# EAGLE design Central relay (EAGLE 6.4)
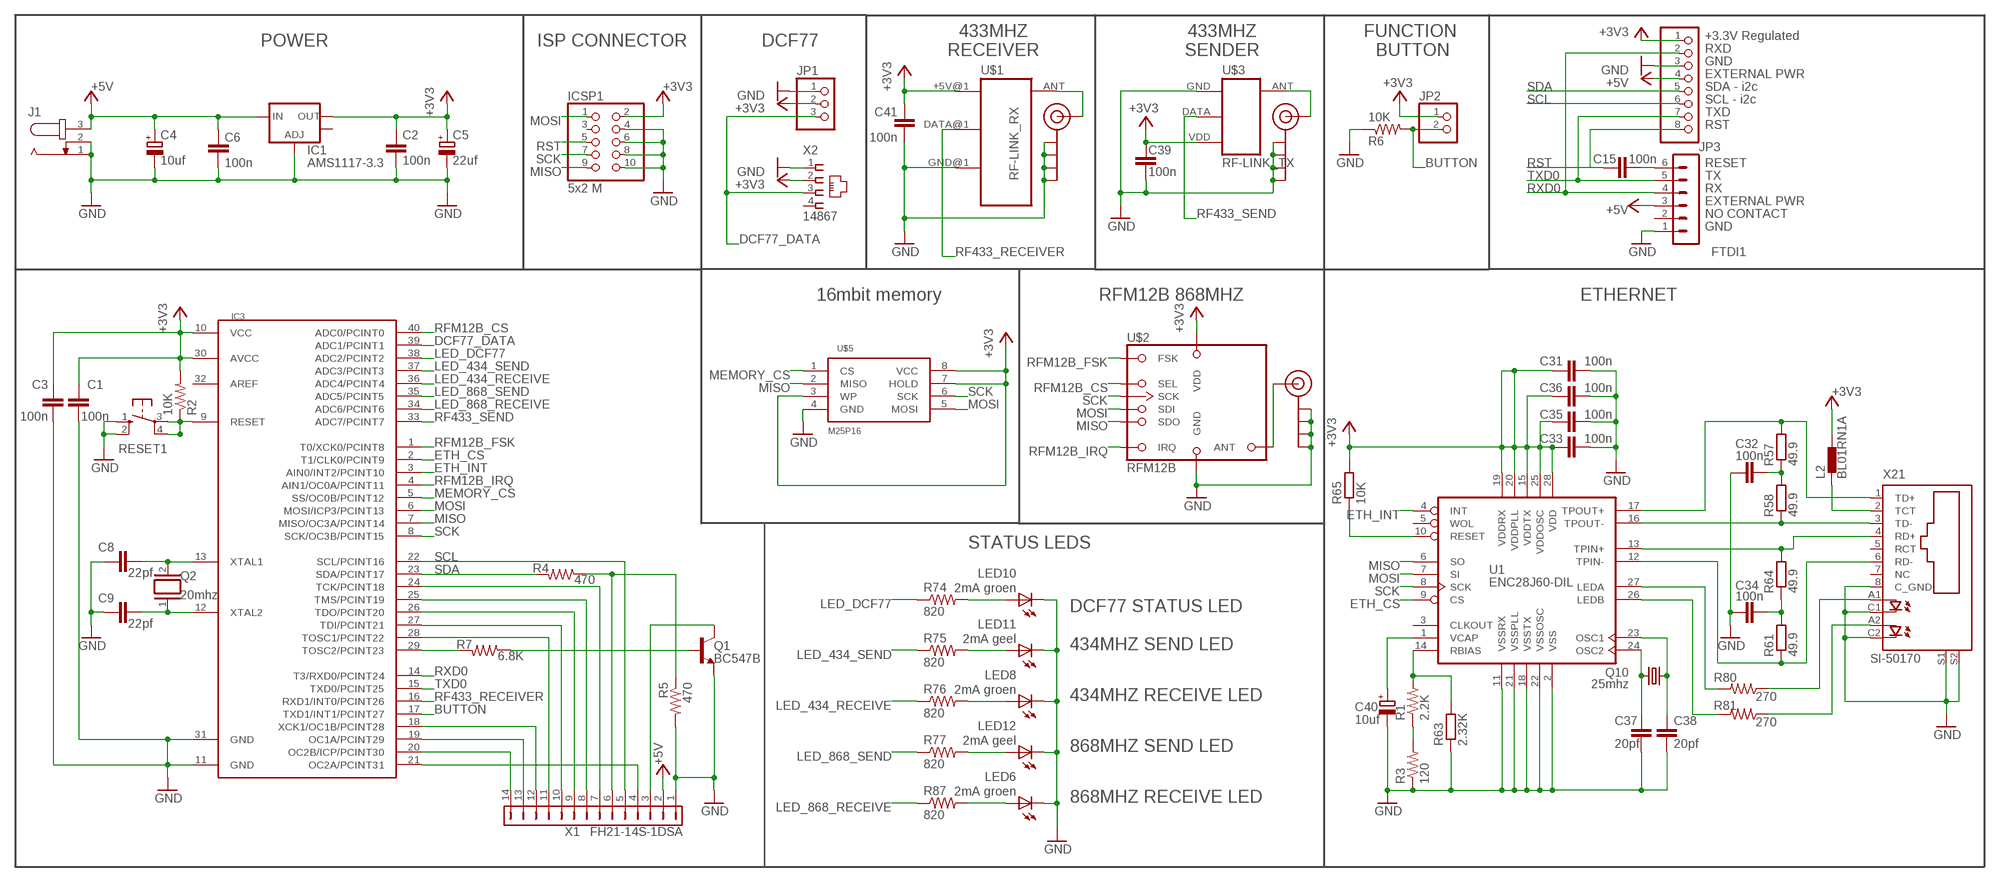
[diagram p0: schematic, sheet 1]

## Parts
C1  100n  CAP0805  [0805]
C2  100n  CAP0805  [0805]
C3  100n  CAP0805  [0805]
C4  10uf  CPOL-EUE2,5-6E  [E2,5-6E]
C5  22uf  CPOL-EUE2,5-6E  [E2,5-6E]
C6  100n  CAP0805  [0805]
C8  22pf  CAP0805  [0805]
C9  22pf  CAP0805  [0805]
C15  100n  C-EU025-025X050  [C025-025X050]
C31  100n  CAP0805  [0805]
C32  100n  CAP0805  [0805]
C33  100n  CAP0805  [0805]
C34  100n  CAP0805  [0805]
C35  100n  CAP0805  [0805]
C36  100n  CAP0805  [0805]
C37  20pf  CAP0805  [0805]
C38  20pf  CAP0805  [0805]
C39  100n  CAP0805  [0805]
C40  10uf  CPOL-EUE2,5-6E  [E2,5-6E]
C41  100n  CAP0805  [0805]
FTDI1  FTDI  MA06-1  [MA06-1]
IC1  AMS1117-3.3  V_REG_LM1117SOT223  [SOT223]
IC3  MEGA1284P  [DIL40]
ICSP1  5x2 M  PINHD-2X5  [2X05]
J1  JACK-PLUG0  [SPC4077]
J$1  SMA_EDGE  [SMA-EDGE]
J$2  SMA_EDGE  [SMA-EDGE]
J$3  SMA_EDGE  [SMA-EDGE]
JP1  PINHD-1X3  [1X03]
JP2  PINHD-1X2  [1X02]
JP3  PINHD-1X8  [1X08]
L2  BL01RN1A  [BL01RN1A]
LED6  2mA groen  LED5MM  [LED5MM]
LED8  2mA groen  LED5MM  [LED5MM]
LED10  2mA groen  LED5MM  [LED5MM]
LED11  2mA geel  LED5MM  [LED5MM]
LED12  2mA geel  LED5MM  [LED5MM]
Q1  BC547B  [TO92]
Q2  20mhz  XTAL/S  [QS]
Q10  25mhz  CRYSTALHC49S  [HC49/S]
R1  2.2K  RESISTOR0805-RES  [0805]
R2  10K  RESISTOR0805-RES  [0805]
R3  120  RESISTOR0805-RES  [0805]
R4  470  RESISTOR0805-RES  [0805]
R5  470  RESISTOR0805-RES  [0805]
R6  10K  RESISTOR0805-RES  [0805]
R7  6.8K  RESISTOR0805-RES  [0805]
R57  49.9  R-EU_0207/7  [0207/7]
R58  49.9  R-EU_0207/7  [0207/7]
R61  49.9  R-EU_0207/7  [0207/7]
R63  2.32K  R-EU_0207/7  [0207/7]
R64  49.9  R-EU_0207/7  [0207/7]
R65  10K  R-EU_0207/7  [0207/7]
R74  820  RESISTOR0805-RES  [0805]
R75  820  RESISTOR0805-RES  [0805]
R76  820  RESISTOR0805-RES  [0805]
R77  820  RESISTOR0805-RES  [0805]
R80  270  RESISTOR0805-RES  [0805]
R81  270  RESISTOR0805-RES  [0805]
R87  820  RESISTOR0805-RES  [0805]
RESET1  10-XX  [B3F-10XX]
U1  ENC28J60-DIL  [DIL28-3]
U$1  RF-LINK_RX  [RF-LINK_RX]
U$2  RFM12B  RFM12B_BREAKOUT_BASE  [RFM12B-BREAKOUT-BASE]
U$3  RF-LINK_TX  [RF-LINK_TX]
U$5  M25P16  SPI_FLASH-X25XXSMD  [SO08]
X1  FH21-14S-1DSA  [FH21-14S-1DSA]
X2  14867  [14867]
X21  SI-50170  [SI-50170]

## Nets
+3V3: C1.2 C2.2 C3.2 C5.+ C31.1 C33.1 C35.2 C36.2 C39.2 C41.1 IC1.2(OUT) IC3.10(VCC) IC3.30(AVCC) ICSP1.2 JP1.2 JP2.1 JP3.1 L2.2 R2.2 R65.2 U1.15(VDDTX) U1.19(VDDRX) U1.20(VDDPLL) U1.25(VDDOSC) U1.28(VDD) U$1.+5V@1(+5V) U$2.9(VDD) U$3.VDD(GND) U$5.3(WP) U$5.7(HOLD) U$5.8(VCC) X2.2
+5V: C4.+ C6.2 FTDI1.3 IC1.3(IN) J1.3 JP3.4 X1.2
BUTTON: IC3.17(TXD1/INT1/PCINT27) JP2.2 R6.2
DCF77_DATA: IC3.39(ADC1/PCINT1) JP1.3 X2.3
ETH_CS: IC3.2(T1/CLK0/PCINT9) U1.9(CS)
ETH_INT: IC3.3(AIN0/INT2/PCINT10) U1.4(INT)
GND [power]: C1.1 C2.1 C3.1 C4.- C5.- C6.1 C8.2 C9.2 C31.2 C32.1 C33.2 C34.1 C35.1 C36.1 C37.1 C38.1 C39.1 C40.- C41.2 FTDI1.1 IC1.1(ADJ) IC3.11(GND) IC3.31(GND) ICSP1.4 ICSP1.6 ICSP1.8 ICSP1.10 J1.1 J1.2 J$1.GND@0(GND) J$1.GND@1(GND) J$1.GND@2(GND) J$1.GND@3(GND) J$2.GND@0(GND) J$2.GND@1(GND) J$2.GND@2(GND) J$2.GND@3(GND) J$3.GND@0(GND) J$3.GND@1(GND) J$3.GND@2(GND) J$3.GND@3(GND) JP1.1 JP3.3 LED6.K(C) LED8.K(C) LED10.K(C) LED11.K(C) LED12.K(C) Q1.1(E) R3.1 R5.2 R6.1 R63.1 RESET1.1(S) RESET1.2(S1) U1.2(VSS) U1.11(VSSRX) U1.18(VSSTX) U1.21(VSSPLL) U1.22(VSSOSC) U$1.GND@1(GND) U$2.10(GND) U$3.GND(+5V) U$5.4(GND) X1.1 X2.1 X21.8(C_GND) X21.C1(C) X21.C2(C1) X21.S1 X21.S2
LED_434_RECEIVE: IC3.36(ADC4/PCINT4) R76.1
LED_434_SEND: IC3.37(ADC3/PCINT3) R75.1
LED_868_RECEIVE: IC3.34(ADC6/PCINT6) R87.1
LED_868_SEND: IC3.35(ADC5/PCINT5) R77.1
LED_DCF77: IC3.38(ADC2/PCINT2) R74.1
MEMORY_CS: IC3.5(SS/OC0B/PCINT12) U$5.1(CS)
MISO: IC3.7(MISO/OC3A/PCINT14) ICSP1.9 U1.6(SO) U$2.1(SDO) U$5.2(MISO)
MOSI: IC3.6(MOSI/ICP3/PCINT13) ICSP1.1 U1.7(SI) U$2.12(SDI) U$5.5(MOSI)
N$1: J$2.SIG(SIGNAL) U$1.ANT
N$2: R80.1 X21.A1(A)
N$3: J$3.SIG(SIGNAL) U$3.ANT
N$4: R1.1 R3.2
N$5: R1.2 R63.2 U1.14(RBIAS)
N$6: R81.1 X21.A2(A1)
N$7: LED8.A R76.2
N$8: IC3.21(OC2A/PCINT31) X1.4
N$9: Q1.3(C) X1.3
N$10: Q1.2(B) R7.1
N$11: R4.1 R5.1 X1.6
N$12: IC3.29(TOSC2/PCINT23) R7.2
N$13: LED11.A R75.2
N$17: IC3.24(TCK/PCINT18) X1.7
N$18: IC3.25(TMS/PCINT19) X1.8
N$19: IC3.26(TDO/PCINT20) X1.9
N$20: LED10.A R74.2
N$23: IC3.27(TDI/PCINT21) X1.10
N$24: IC3.28(TOSC1/PCINT22) X1.11
N$28: LED6.A R87.2
N$29: LED12.A R77.2
N$30: C8.1 IC3.13(XTAL1) Q2.2
N$33: L2.1 X21.2(TCT)
N$34: C34.2 R61.2 R64.1
N$35: R57.2 U1.17(TPOUT+) X21.1(TD+)
N$37: R58.1 U1.16(TPOUT-) X21.3(TD-)
N$39: IC3.20(OC2B/ICP/PCINT30) X1.14
N$40: IC3.19(OC1A/PCINT29) X1.13
N$41: IC3.18(XCK1/OC1B/PCINT28) X1.12
N$43: C9.1 IC3.12(XTAL2) Q2.1
N$49: C15.2 FTDI1.6
N$94: R64.2 U1.13(TPIN+) X21.4(RD+)
N$95: R61.1 U1.12(TPIN-) X21.6(RD-)
N$96: C37.2 Q10.1 U1.24(OSC2)
N$97: C38.2 Q10.2 U1.23(OSC1)
N$98: C40.+ U1.1(VCAP)
N$100: R65.1 U1.10(RESET)
N$101: C32.2 R57.1 R58.2
N$141: R80.2 U1.27(LEDA)
N$142: R81.2 U1.26(LEDB)
N$145: J$1.SIG(SIGNAL) U$2.8(ANT)
RF433_RECEIVER: IC3.16(RXD1/INT0/PCINT26) U$1.DATA@1(DATA)
RF433_SEND: IC3.33(ADC7/PCINT7) U$3.DATA
RFM12B_CS: IC3.40(ADC0/PCINT0) U$2.14(SEL)
RFM12B_FSK: IC3.1(T0/XCK0/PCINT8) U$2.3(FSK)
RFM12B_IRQ: IC3.4(AIN1/OC0A/PCINT11) U$2.2(IRQ)
RST: C15.1 IC3.9(RESET) ICSP1.5 JP3.8 R2.1 RESET1.3(P) RESET1.4(P1)
RXD0: FTDI1.4 IC3.14(T3/RXD0/PCINT24) JP3.2
SCK: IC3.8(SCK/OC3B/PCINT15) ICSP1.7 U1.8(SCK) U$2.13(SCK) U$5.6(SCK)
SCL: IC3.22(SCL/PCINT16) JP3.6 X1.5
SDA: IC3.23(SDA/PCINT17) JP3.5 R4.2
TXD0: FTDI1.5 IC3.15(TXD0/PCINT25) JP3.7
Unconnected: FTDI1.2 IC1.4(OUT) IC3.32(AREF) ICSP1.3 U1.3(CLKOUT) U1.5(WOL) X2.4 X21.5(RCT) X21.7(NC)

## Notes on the sheet
- POWER | ISP CONNECTOR | DCF77
- 433MHZ
  RECEIVER
- 433MHZ
  SENDER
- FUNCTION 
  BUTTON
- +3.3V Regulated
- RXD
- GND
- EXTERNAL PWR
- SDA - i2c
- SCL - i2c
- TXD
- RST
- RESET
- TX
- RX
- EXTERNAL PWR
- NO CONTACT
- GND
- 16mbit memory | RFM12B 868MHZ | ETHERNET
- STATUS LEDS
- DCF77 STATUS LED
- 434MHZ SEND LED
- 434MHZ RECEIVE LED
- 868MHZ SEND LED
- 868MHZ RECEIVE LED

## Library data of the parts
C1-C3 C6 C8 C9 C31-C39 C41 = SparkFun-Capacitors:CAP: Capacitor Standard 0603 ceramic capacitor, and 0.1" leaded capacitor.
C4 C5 = rcl:CPOL-EU: POLARIZED CAPACITOR, European symbol
C15 = resistor:C-EU: CAPACITOR, European symbol
C40 = resistor:CPOL-EU: POLARIZED CAPACITOR, European symbol
FTDI1 = JeeLabs:MA06-1: PIN HEADER
IC1 = SparkFun-PowerIC:V_REG_LM1117: Voltage Regulator LM1117 Standard adjustable voltage regulator but in SMD form. Spark Fun Electronics SKU : COM-00595
IC3 = 1284p:MEGA1284P: Atmel ATmega1284P 8-bit AVR Microcontroller
ICSP1 = pinhead:PINHD-2X5: PIN HEADER
J1 = con-jack:JACK-PLUG: DC POWER JACK Power Jack, DC, Right Angle, Through Hole, Rated 5A at 16VDC, PC Terminals Distributor: Farnell (www.Farnell.de) Drawing: 84N1161.pdf / 84N1162.pdf Manufacturer: SPC Technology (www.spctechnology.com) Type: SPC4077 / SPC 4078; OC_FARNELL: unknown; OC_NEWARK: unknown
J$1-J$3 = SparkFun-Connectors:SMA_EDGE: SMA Antenna Connector End launch SMA connector. The paste layer has been removed so that the connector can be hand soldered onto the board after reflow.
JP1 = adafruit:PINHD-1X3: PIN HEADER
JP2 = pinhead:PINHD-1X2: PIN HEADER
JP3 = pinhead:PINHD-1X8: PIN HEADER
L2 = inductors:BL0: Noise Suppression Products/EMI Suppression Filters, Lead EMIFIL(R) Inductor Type Source: http://www.murata.com .. BL01RN1_DS.pdf
LED6 LED8 LED10-LED12 = led:LED: LED OSRAM: - CHIPLED LG R971, LG N971, LY N971, LG Q971, LY Q971, LO R971, LY R971 LH N974, LH R974 LS Q976, LO Q976, LY Q976 LO Q996 - Hyper CHIPLED LW Q18S LB Q993, LB Q99A, LB R99A - SideLED LS A670, LO A670, LY A670, LG A670, LP A670 LB A673, LV A673, LT A673, LW A673 LH A674 LY A675 LS A676, LA A676, LO A676, LY A676, LW A676 LS A679, LY A679, LG A679 - Hyper Micro SIDELED® LS Y876, LA Y876, LO Y876, LY Y876 LT Y87S - SmartLED LW L88C, LW L88S LB L89C, LB L89S, LG L890 LS L89K, LO L89K, LY L89K LS L896, LA L896, LO L896, LY L896 - TOPLED LS T670, LO T670, LY T670, LG T670, LP T670 LSG T670, LSP T670, LSY T670, LOP T670, LYG T670 LG T671, LOG T671, LSG T671 LB T673, LV T673, LT T673, LW T673 LH T674 LS T676, LA T676, LO T676, LY T676, LB T676, LH T676, LSB T676, LW T676 LB T67C, LV T67C, LT T67C, LS T67K, LO T67K, LY T67K, LW E67C LS E67B, LA E67B, LO E67B, LY E67B, LB E67C, LV E67C, LT E67C LW T67C LS T679, LY T679, LG T679 LS T770, LO T770, LY T770, LG T770, LP T770 LB T773, LV T773, LT T773, LW T773 LH T774 LS E675, LA E675, LY E675, LS T675 LS T776, LA T776, LO T776, LY T776, LB T776 LHGB T686 LT T68C, LB T68C - Hyper Mini TOPLED® LB M676 - Mini TOPLED Santana® LG M470 LS M47K, LO M47K, LY M47K Source: http://www.osram.convergy.de LUXEON: - LUMILED® LXK2-PW12-R00, LXK2-PW12-S00, LXK2-PW14-U00, LXK2-PW14-V00 LXK2-PM12-R00, LXK2-PM12-S00, LXK2-PM14-U00 LXK2-PE12-Q00, LXK2-PE12-R00, LXK2-PE12-S00, LXK2-PE14-T00, LXK2-PE14-U00 LXK2-PB12-K00, LXK2-PB12-L00, LXK2-PB12-M00, LXK2-PB14-N00, LXK2-PB14-P00, LXK2-PB14-Q00 LXK2-PR12-L00, LXK2-PR12-M00, LXK2-PR14-Q00, LXK2-PR14-R00 LXK2-PD12-Q00, LXK2-PD12-R00, LXK2-PD12-S00 LXK2-PH12-R00, LXK2-PH12-S00 LXK2-PL12-P00, LXK2-PL12-Q00, LXK2-PL12-R00 Source: www.luxeon.com KINGBRIGHT: KA-3528ASYC Source: www.kingbright.com
Q1 = transistor-npn:BC547*: NPN Transistor
Q2 = special:XTAL/S: CRYSTAL
Q10 = crystal:CRYSTAL: CRYSTAL; OC_FARNELL: 1667008; OC_NEWARK: unknown
R1-R7 R74-R77 R80 R81 R87 = SparkFun-Resistors:RESISTOR: Resistor Basic schematic elements and footprints for 0603, 1206, and PTH resistors.
R57 R58 R61 R63-R65 = resistor:R-EU_: RESISTOR, European symbol
RESET1 = switch-omron:10-XX: OMRON SWITCH; MPN: B3F-1000; OC_FARNELL: 176432; OC_NEWARK: 36M3542
U1 = enc28j60:ENC28J60-*: Microchip 10Mbit Ethernet controller with SPI interface Improved SOIC28 layout (pads in 0.01 raster, pin1 slightly smaller). Pin 6 (SO) changed from Out (paralleling several Outs gives an error) to OC. Author: Profi from mikrocontroller.net - forum Date: 2006.0827
U$1 = SparkFun-RF:RF-LINK_RX: RF Link receivers- WRL-8947, 8948, 8949, 8950
U$2 = RFM12_BREAKOUT:RFM12B_BREAKOUT_BASE
U$3 = SparkFun-RF:RF-LINK_TX: RF Link transmitters WRL-8945, 8946
U$5 = SparkFun-DigitalIC:SPI_FLASH-X25XX: 8pin SPI Flash series x25xx. Works with devices like W25X32 and BR25L32
X1 = con-hirose:FH21-14S-1DSA: FPC CONNECTOR Source: con-hirose.lbr from Bob Starr <rtzaudio@mindspring.com>; OC_FARNELL: unknown; OC_NEWARK: unknown
X2 = con-4ucon:14867: RJ11 Connector Source: 4UCON TECHNOLOGY INC. 14867.pdf; OC_FARNELL: unknown; OC_NEWARK: unknown
X21 = con-stewart:SI-50170: Ethernet Connector MagJack (R) Source: www.stewartconnector.com .. si-50170.pdf; OC_FARNELL: unknown; OC_NEWARK: unknown

## Net classes
1 power: width 0.381 mm, clearance 0.254 mm
2 gnd: width 0.305 mm, drill 0.559 mm, clearance 0.254 mm
3 usbvcc: width 0.508 mm, drill 0.61 mm, clearance 0.254 mm

## Board
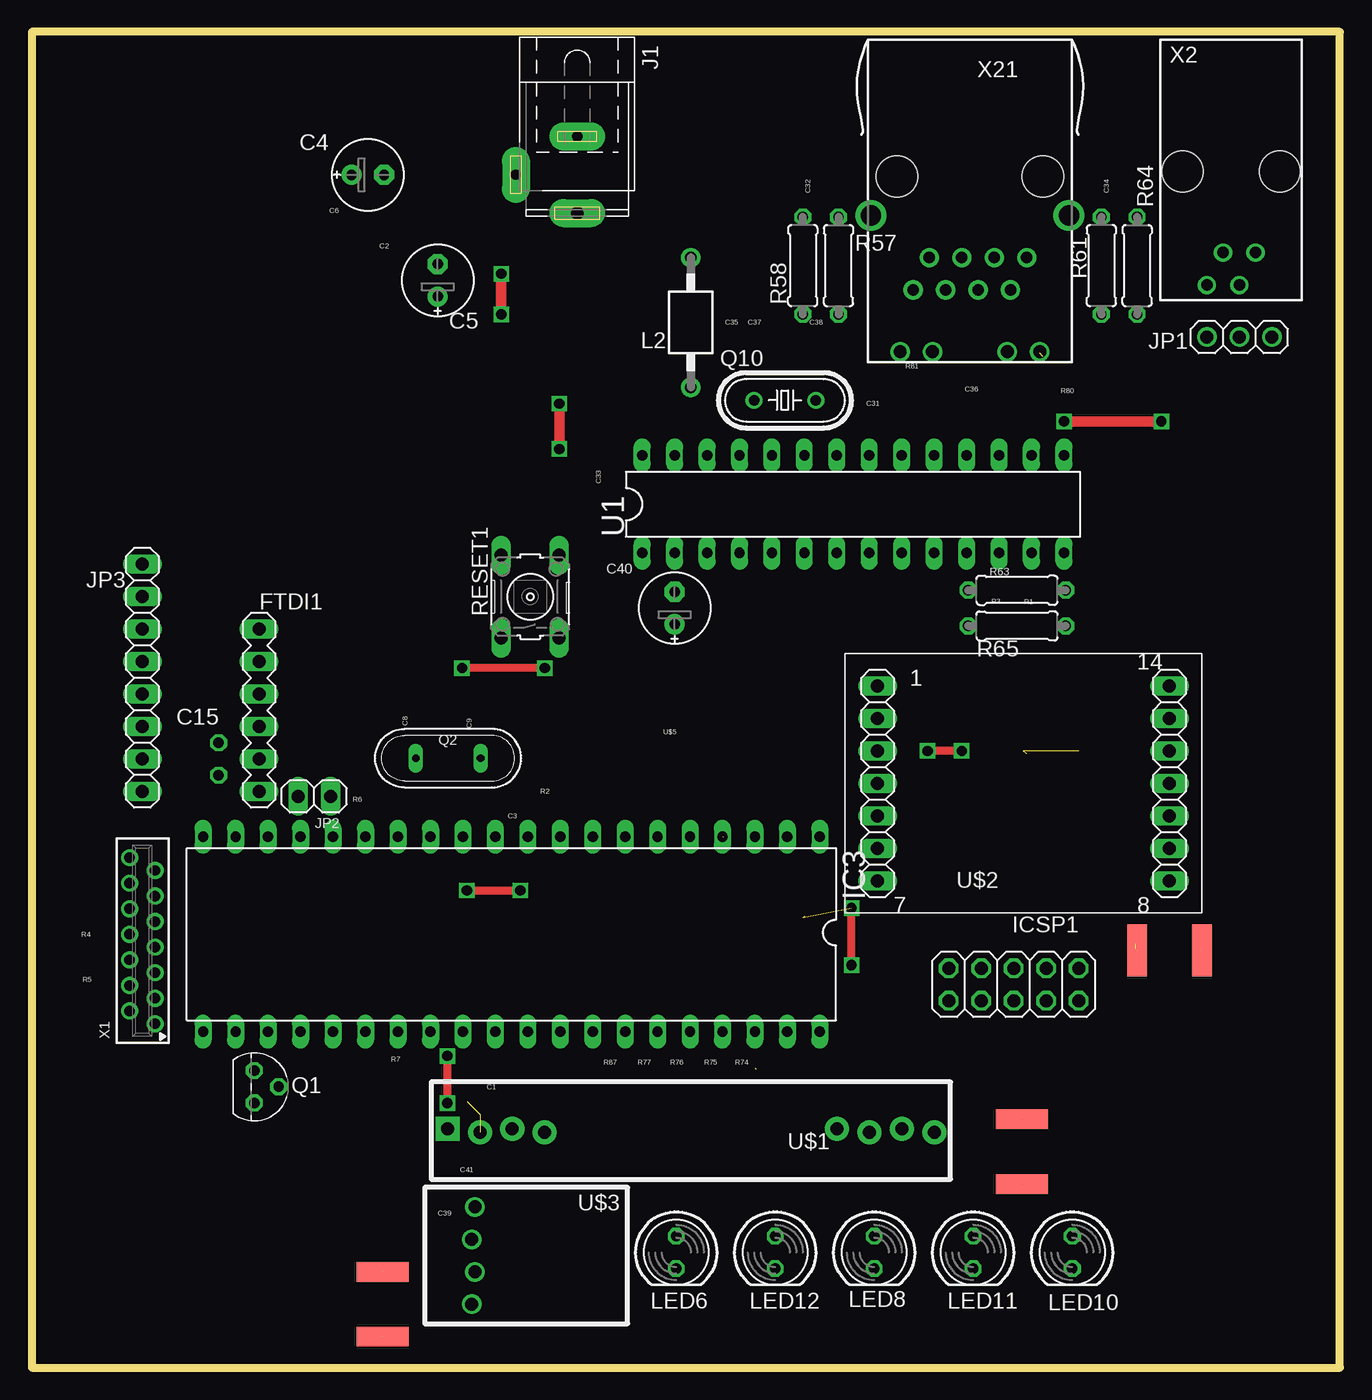
[diagram p1: board, top side]
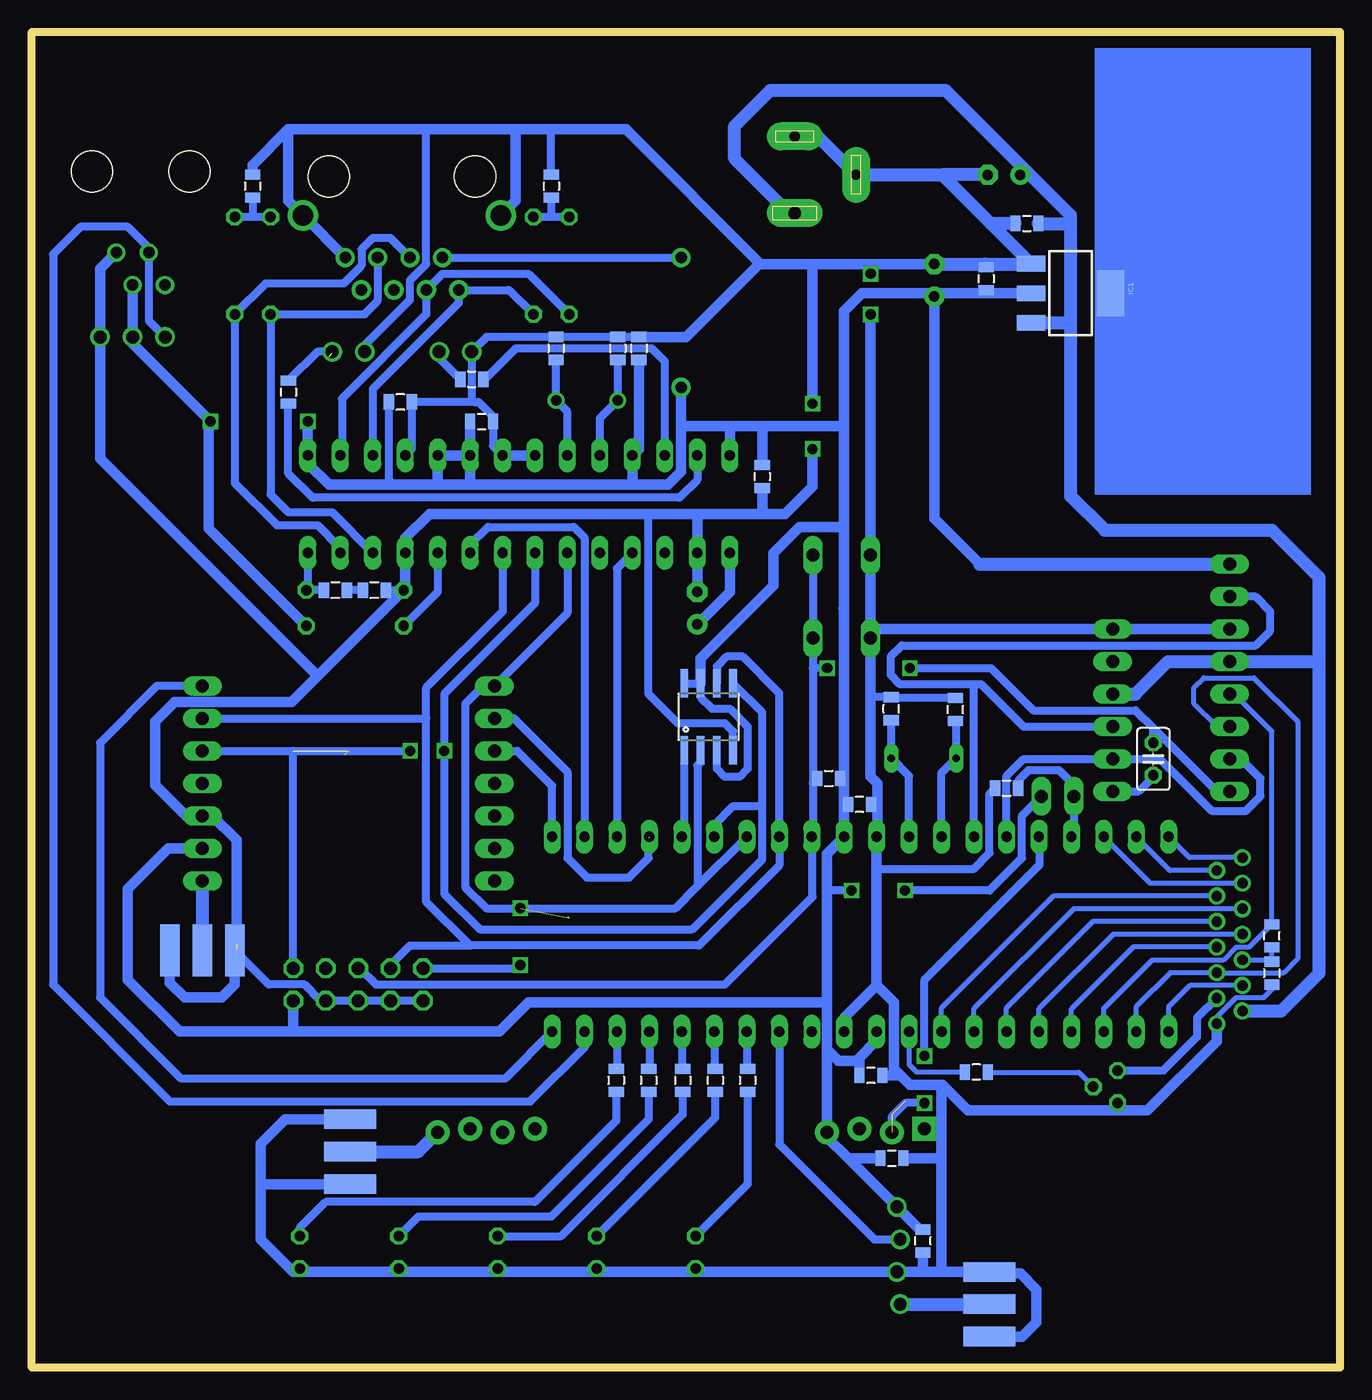
[diagram p2: board, bottom side, seen from below]

Size 102.36 x 104.52 mm. Coordinates in mm from the lower left corner, seen from the top.
Outline: 0,0 102.36,0 102.36,104.52 0,104.52 0,0
Copper layers (1*16): Top 0.035mm / dielectric 1.5mm / Bottom 0.035mm
Design rules "default *": minimum track width 10mil, minimum drill 24mil, track to track 8mil, track to pad 8mil, pad to pad 8mil, via to via 8mil, smd to smd 8mil, copper to edge 40mil, drill to drill 8mil, minimum pad ring 10mil, minimum via ring 8mil, stop-mask expansion 4mil, vias tented up to drill 0mil, thermal gap 10mil

### Footprints (pad centres in the part's own frame; a part is rotated, then mirrored left to right if it is on the bottom)
0805 = smd 0.8 x 1.2: 1 -0.9,0; 2 0.9,0
E2,5-6E = drill 0.813 pad 1.575: + -1.27,0 | drill 0.813 pad 1.575 octagon: - 1.27,0
C025-025X050 = drill 0.813 octagon: 1 -1.27,0; 2 1.27,0
MA06-1 = drill 1.016 long: 1 0,0; 2 2.54,0; 3 5.08,0; 4 7.62,0; 5 10.16,0; 6 12.7,0
SOT223 = smd 1.219 x 2.235: 1 -2.311,-3.099; 2 0,-3.099; 3 2.311,-3.099 | smd 3.6 x 2.2: 4 0,3.099
DIL40 = drill 0.813 long: 1 -24.13,-7.62; 2 -21.59,-7.62; 3 -19.05,-7.62; 4 -16.51,-7.62; 5 -13.97,-7.62; 6 -11.43,-7.62; 7 -8.89,-7.62; 8 -6.35,-7.62; 9 -3.81,-7.62; 10 -1.27,-7.62; 11 1.27,-7.62; 12 3.81,-7.62; 13 6.35,-7.62; 14 8.89,-7.62; 15 11.43,-7.62; 16 13.97,-7.62; 17 16.51,-7.62; 18 19.05,-7.62; 19 21.59,-7.62; 20 24.13,-7.62; 21 24.13,7.62; 22 21.59,7.62; 23 19.05,7.62; 24 16.51,7.62; 25 13.97,7.62; 26 11.43,7.62; 27 8.89,7.62; 28 6.35,7.62; 29 3.81,7.62; 30 1.27,7.62; 31 -1.27,7.62; 32 -3.81,7.62; 33 -6.35,7.62; 34 -8.89,7.62; 35 -11.43,7.62; 36 -13.97,7.62; 37 -16.51,7.62; 38 -19.05,7.62; 39 -21.59,7.62; 40 -24.13,7.62
2X05 = drill 1.016 octagon: 1 -5.08,-1.27; 2 -5.08,1.27; 3 -2.54,-1.27; 4 -2.54,1.27; 5 0,-1.27; 6 0,1.27; 7 2.54,-1.27; 8 2.54,1.27; 9 5.08,-1.27; 10 5.08,1.27
SPC4077 = drill 0.8 pad 2.184 long: 1 -3,0; 2 0,-4.8 | drill 1 pad 2.184 long: 3 3,0
SMA-EDGE = smd 1.524 x 4.064: GND@0 0,0; GND@1 5.08,0; SIG 2.54,0 | smd 1.524 x 4.064 bottom: GND@2 0,0; GND@3 5.08,0
1X03 = drill 1.016: 1 -2.54,0; 2 0,0; 3 2.54,0
1X02 = drill 1.016 long: 1 -1.27,0; 2 1.27,0
1X08 = drill 1.016 long: 1 -8.89,0; 2 -6.35,0; 3 -3.81,0; 4 -1.27,0; 5 1.27,0; 6 3.81,0; 7 6.35,0; 8 8.89,0
BL01RN1A = drill 0.9 pad 1.5: 1 -5.08,0; 2 5.08,0
LED5MM = drill 0.813 octagon: A -1.27,0; K 1.27,0
TO92 = drill 0.813 octagon: 1 1.27,0; 2 0,1.905; 3 -1.27,0
QS = drill 0.61 long: 1 -2.54,0; 2 2.54,0
HC49/S = drill 0.813: 1 -2.413,0; 2 2.413,0
0207/7 = drill 0.813 octagon: 1 -3.81,0; 2 3.81,0
B3F-10XX = drill 1.016 long: 1 -3.251,2.261; 2 3.251,2.261; 3 -3.251,-2.261; 4 3.251,-2.261
DIL28-3 = drill 0.813 long: 1 -16.51,-3.81; 2 -13.97,-3.81; 3 -11.43,-3.81; 4 -8.89,-3.81; 5 -6.35,-3.81; 6 -3.81,-3.81; 7 -1.27,-3.81; 8 1.27,-3.81; 9 3.81,-3.81; 10 6.35,-3.81; 11 8.89,-3.81; 12 11.43,-3.81; 13 13.97,-3.81; 14 16.51,-3.81; 15 16.51,3.81; 16 13.97,3.81; 17 11.43,3.81; 18 8.89,3.81; 19 6.35,3.81; 20 3.81,3.81; 21 1.27,3.81; 22 -1.27,3.81; 23 -3.81,3.81; 24 -6.35,3.81; 25 -8.89,3.81; 26 -11.43,3.81; 27 -13.97,3.81; 28 -16.51,3.81
RF-LINK_RX = drill 1.016 pad 1.88: +5V@1 7.62,-0.127; +5V@2 30.48,0.127; ANT 38.1,-0.127; DATA@1 2.54,-0.127; DATA@2 5.08,0.127; GND@2 33.02,-0.127; GND@3 35.56,0.127 | drill 1.016 pad 1.88 square: GND@1 0,0.127
RFM12B-BREAKOUT-BASE = drill 1.016 long: 1 -11.43,7.62; 2 -11.43,5.08; 3 -11.43,2.54; 4 -11.43,0; 5 -11.43,-2.54; 6 -11.43,-5.08; 7 -11.43,-7.62; 8 11.43,-7.62; 9 11.43,-5.08; 10 11.43,-2.54; 11 11.43,0; 12 11.43,2.54; 13 11.43,5.08; 14 11.43,7.62
RF-LINK_TX = drill 1.016 pad 1.524: ANT 7.62,-0.127; DATA 2.54,-0.127; GND 5.08,0.127; VDD 0,0.127
SO08 = smd 0.61 x 2.21: 1 -1.905,-2.616; 2 -0.635,-2.616; 3 0.635,-2.616; 4 1.905,-2.616; 5 1.905,2.616; 6 0.635,2.616; 7 -0.635,2.616; 8 -1.905,2.616
FH21-14S-1DSA = drill 0.813: 1 -6.5,-1; 2 -5.5,1; 3 -4.5,-1; 4 -3.5,1; 5 -2.5,-1; 6 -1.5,1; 7 -0.5,-1; 8 0.5,1; 9 1.5,-1; 10 2.5,1; 11 3.5,-1; 12 4.5,1; 13 5.5,-1; 14 6.5,1
14867 = drill 0.9 pad 1.422: 1 -1.905,6.35; 2 -0.635,8.89; 3 0.635,6.35; 4 1.905,8.89 | hole 3.2: -3.81,0; 3.81,0
SI-50170 = drill 0.9 pad 1.5: 1 4.445,5.842; 2 3.175,3.302; 3 1.905,5.842; 4 0.635,3.302; 5 -0.635,5.842; 6 -1.905,3.302; 7 -3.175,5.842; 8 -4.445,3.302 | drill 1.016 pad 1.5: A1 -5.461,10.668; A2 2.921,10.668; C1 -2.921,10.668; C2 5.461,10.668 | drill 1.6 pad 2.2: S1 -7.747,0; S2 7.747,0 | hole 3.251: -5.715,-3.048; 5.715,-3.048

### Placement (x,y rotation side)
C1  36.7,22.86 180 bottom
C2  27.69,85.22 270 bottom
C3  37.59,44.07 180 bottom
C4  26.29,93.34 0 top
C5  31.75,85.09 90 top
C6  24.51,89.54 0 bottom
C8  30.1,51.5 90 bottom
C9  35.12,51.56 90 bottom
C15  14.61,47.62 270 bottom
C31  67.18,74.04 0 bottom
C32  61.72,92.46 270 bottom
C33  45.21,69.72 270 bottom
C34  85.09,92.46 270 bottom
C35  54.86,79.76 270 bottom
C36  73.53,75.56 180 bottom
C37  56.52,79.76 270 bottom
C38  61.34,79.76 270 bottom
C39  32.64,9.91 90 bottom
C40  50.29,59.44 90 top
C41  35.05,16.38 0 bottom
FTDI1  17.78,57.78 270 top
IC1  21.08,84.07 270 bottom
IC3  37.53,33.91 180 top
ICSP1  76.84,29.97 180 top
J1  42.67,93.34 270 top
J$1  86.49,32.64 180 bottom
J$2  77.47,14.35 90 bottom
J$3  27.43,2.41 90 bottom
JP1  94.49,80.65 180 top
JP2  22.1,44.7 180 top
JP3  8.64,53.97 270 top
L2  51.56,81.79 270 top
LED6  50.42,9.02 270 top
LED8  65.91,9.02 270 top
LED10  81.41,9.02 270 top
LED11  73.66,9.02 270 top
LED12  58.17,9.02 270 top
Q1  17.4,21.97 270 top
Q2  32.58,47.69 180 top
Q10  58.93,75.69 0 top
R1  78.61,60.83 180 bottom
R2  40.01,46.1 0 bottom
R3  75.56,60.83 180 bottom
R4  5.33,33.78 90 bottom
R5  5.33,30.86 270 bottom
R6  26.09,45.34 0 bottom
R7  28.46,23.12 180 bottom
R57  63.12,86.23 270 top
R58  60.32,86.23 90 top
R61  83.69,86.23 90 top
R63  77.09,60.83 0 top
R64  86.49,86.23 270 top
R65  77.09,58.04 0 top
R74  56.64,22.48 270 bottom
R75  54.1,22.48 270 bottom
R76  51.44,22.48 270 bottom
R77  48.9,22.48 270 bottom
R80  82.3,76.33 270 bottom
R81  67.94,77.34 0 bottom
R87  46.35,22.48 270 bottom
RESET1  38.99,60.32 90 top
U1  64.26,67.56 0 top
U$1  32.51,18.54 0 top
U$2  77.6,45.72 0 top
U$3  34.54,12.57 270 top
U$5  49.4,50.93 0 bottom
X1  8.64,33.4 90 top
X2  93.85,93.6 180 top
X21  73.41,90.17 180 top

### Tracks (layer width: path | path; a pad name or v marks a point on that pad's centre or on a via)
+3V3  (via drill 0.8)
  Top 0.61: v34.04,37.34 v38.23,37.34
  Top 0.813: v80.77,74.04 v88.39,74.04
  Bottom 0.61: 38.81,41.54 IC3.10 | 80.77,71.5 U1.15 | 38.94,59.44 38.81,59.56 | 38.81,54.99 38.81,54.18 38.73,54.1 | C3.2 38.49,44.01 38.81,43.69 | U$5.3 48.77,46.86 48.13,46.23 46.99,46.23 46.35,46.86 46.35,50.16 47.75,51.56 49.15,51.56 50.04,52.45 U$5.7 U$5.8 | C36.2 74.43,69.35 74.42,69.34 | v34.04,37.34 27.43,37.34 24.89,39.88 24.89,43.18 JP2.1 | v38.23,37.34 40.01,37.34 40.13,37.21 | R2.2 38.81,46.1
  Bottom 0.813: U1.19 U1.20 68.07,71.63 | 37.6,24.25 36.26,25.59 IC3.30 | 37.6,24.25 37.85,24 39.24,24 40.13,24.89 | 40.13,24.89 40.13,28.57 | 40.13,28.57 40.13,37.21 40.13,40.19 IC3.10 | 38.81,41.54 38.81,43.69 38.81,46.1 38.81,54.99 38.81,59.56 38.81,65.91 | 51.56,73.66 L2.2 | 38.81,73.66 38.81,82.68 37.41,84.07 31.75,84.07 | 38.81,73.66 38.81,65.91 | 40.13,24.89 U$1.+5V@1 40.13,18.03 38.48,16.38 | U$2.9 91.69,40.64 94.87,37.46 94.87,30.35 90.81,26.29 81.91,26.29 | 81.91,26.29 65.79,26.29 63.5,28.57 40.13,28.57 | ICSP1.2 81.91,26.29 | 80.77,71.5 v80.77,74.04 | 28.19,62.87 31.75,66.42 C5.+ 31.75,84.07 | C39.2 32.9,10.81 U$3.VDD 38.48,16.38 | C1.2 37.6,24.25 | X2.2 JP1.2 94.49,80.14 v88.39,74.04 88.52,73.91 88.52,65.66 R65.2 | 51.56,73.66 47.75,73.66 | 47.75,73.66 45.21,73.66 | 45.21,73.66 38.81,73.66 | U1.28 47.75,73.66 | C33.1 45.21,73.66 | 80.77,70.48 80.77,70.74 | 80.77,70.74 U1.15 | U1.19 68.33,71.37 68.07,71.63 | 51.56,73.66 51.56,70.1 52.58,69.09 55.63,69.09 | 55.63,69.09 67.94,69.09 | 67.94,69.09 70.74,69.09 | 70.74,69.09 74.42,69.09 | 74.42,69.09 79.12,69.09 80.77,70.74 | U1.19 68.2,71.37 68.07,71.25 68.07,69.22 67.94,69.09 | U1.19 70.61,69.22 70.74,69.09 | 74.42,69.34 74.42,69.09 | 55.63,69.09 55.37,69.34 U1.25 54.86,71.88 C35.2 | C41.1 38.48,16.38 | 38.81,65.91 38.94,65.79 42.29,65.79 44.32,63.75 44.32,61.21 50.04,55.5 U$5.7 | IC1.2 27.69,84.07 | 27.69,84.07 31.75,84.07 | C2.2 27.69,84.07 | 68.07,71.63 68.07,74.03 C31.1
  Bottom 1.016: 28.19,62.87 JP3.1
+5V
  Bottom 1.016: J1.3 43.1,90.34 47.37,94.62 47.37,97.16 44.58,99.95 30.86,99.95 24.51,93.6 | 24.51,93.6 21.08,90.17 21.08,89.54 | 21.08,89.54 21.08,82.04 | C4.+ 24.77,93.34 24.51,93.6 | C6.2 21.08,89.54 | IC1.3 21.36,81.76 21.08,82.04 | 21.08,82.04 21.08,68.2 18.41,65.53 5.33,65.53 1.65,61.85 1.65,54.99 | 1.65,54.99 1.65,30.86 4.61,27.9 X1.2 | FTDI1.3 16,52.7 13.46,55.24 JP3.4 1.9,55.24 1.65,54.99
BUTTON
  Bottom 0.61: R6.2 25.15,45.38 25.15,45.97 24.38,46.74 21.97,46.74 20.83,45.59 JP2.2 20.83,41.72 IC3.17
DCF77_DATA
  Bottom 0.61: IC3.39 59.05,26.23 59.05,25.15 63.37,20.83 91.57,20.83 100.71,29.97 100.71,87.12 98.55,89.28 94.87,89.28 93.22,87.63 X2.3 93.22,81.92 JP1.3
ETH_CS
  Bottom 0.61: U1.9 68.07,64.39 66.68,65.79 59.94,65.79 59.12,64.96 IC3.2
ETH_INT
  Bottom 0.61: U1.4 56.58,62.55 IC3.3
GND  (via drill 0.8)  (7 unrouted)
  Top 0.813: v36.73,85.6 v36.73,82.42 | v41.27,71.88 v41.27,75.44
  Bottom 0.406: X1.1 9.64,27.45 8.13,28.96 5.96,28.96 5.33,29.58 R5.2 | R6.1 27.18,45.34
  Bottom 0.61: U1.21 66.28,72.12 C31.2 66.28,74.42 67.43,75.56 67.82,75.56 | U1.18 72.63,71.89 C36.1 67.82,75.56 | ICSP1.10 ICSP1.8 ICSP1.6 ICSP1.4 79.76,28.7 81.03,29.97 83.82,29.97 J$1.GND@2 | C35.1 C37.1 C38.1 66.79,80.66 X21.C2 67.94,75.69 67.82,75.56 | X21.C1 76.33,80.01 72.77,83.57 72.77,85.09 71.5,86.36 71.5,96.9 | 36.26,38.86 36.13,38.99 28.7,38.99 27.43,40.26 27.43,44.89 R6.1 | 54.36,66.8 54.1,66.55 54.1,52.7 51.82,50.42 48.13,50.42 47.5,49.78 U$5.4 | 36.73,52.58 36.61,52.46 C9.2 35.05,52.4 C8.2 | R3.1 R63.1 | C32.1 61.72,96.9
  Bottom 0.813: U1.22 U1.21 | 36.26,29.91 36.26,38.86 IC3.11 36.2,41.59 36.2,44.2 | 36.26,29.91 38.73,27.43 38.73,26.35 IC3.31 | C40.- U1.2 50.29,66.67 50.42,66.8 | 80.01,54.1 82.04,52.07 91.19,52.07 92.71,50.55 92.71,45.59 90.3,43.18 U$2.10 88.26,43.18 86.36,41.27 86.36,32.77 J$1.GND@2 86.49,29.97 87.5,28.96 90.42,28.96 91.57,30.1 J$1.GND@3 | 80.01,54.1 R63.1 73.15,60.96 U1.11 73.15,64.9 71.25,66.8 54.36,66.8 50.42,66.8 | 86.36,33.15 86.36,33.78 | C35.1 54.86,80.65 51.18,80.65 45.47,86.36 45.34,86.36 | v41.27,71.88 41.27,68.96 43.43,66.8 45.09,66.8 | 36.73,58.17 RESET1.1 36.73,52.58 36.73,46.25 36.2,45.72 36.2,44.2 | 36.73,58.17 RESET1.2 v36.73,82.42 36.73,82.4 | 36.73,58.17 36.35,57.78 FTDI1.1 JP3.3 | 36.26,29.91 36.26,29.78 36.13,29.78 34.92,28.57 34.92,23.39 34.42,22.89 | 32.64,7.49 U$3.GND 50.16,7.49 | 32.64,7.49 30.99,7.49 | 30.99,7.49 J$3.GND@1 | J$3.GND@1 27.05,7.49 26.92,7.37 | 26.92,7.37 27.3,7.37 J$3.GND@1 | 26.92,7.37 25.02,7.37 23.75,6.1 23.75,3.56 24.89,2.41 J$3.GND@0 | v41.27,75.44 41.27,86.36 | C39.1 32.64,7.49 | 64.52,96.9 71.5,96.9 82.3,96.9 | X21.8 X21.S1 82.3,91.31 82.3,96.9 | X2.1 97.03,85.98 JP1.1 97.03,71.12 80.01,54.1 | 50.42,66.8 45.09,66.8 | C33.2 45.21,66.93 45.09,66.8 | 50.16,7.49 58.29,7.49 | 58.29,7.49 65.91,7.49 | 65.91,7.49 73.66,7.49 | LED11.K 73.66,7.49 | LED8.K 65.91,7.49 | LED12.K 58.17,7.62 58.29,7.49 | LED6.K 50.16,7.49 | 84.46,14.1 84.2,14.35 J$2.GND@0 | 84.46,14.1 84.46,10.03 81.91,7.49 81.41,7.49 | 79.12,19.43 J$2.GND@1 82.55,19.43 84.46,17.53 84.46,14.1 | X1.1 9.65,26.89 9.65,25.53 15.07,20.11 17.4,20.11 | 31.18,16.38 31.18,18.67 | 31.18,16.38 31.18,7.68 30.99,7.49
  Bottom 0.813: U$1.GND@1 31.18,18.67 | C41.2 31.18,16.38 | 73.66,7.49 81.41,7.49 | LED10.K 81.41,7.49 | C2.1 27.69,86.23 27.81,86.36 | C5.- 36.7,86.36 | 36.7,86.36 41.27,86.36 | X21.S2 64.52,91.31 64.52,96.9 | C3.1 36.32,44.07 36.2,44.2 | C34.1 85.09,94.11 82.3,96.9 | 41.27,86.36 45.34,86.36 | 64.52,96.9 61.72,96.9 55.88,96.9 45.34,86.36 | v36.73,85.6 36.73,86.34 36.7,86.36 | 31.18,22.11 33.65,22.11 34.42,22.89 | 31.18,22.11 31.13,22.11 29.72,20.7 29.71,20.7 29.12,20.11 17.4,20.11 | C1.1 34.45,22.86 34.42,22.89 | 31.18,18.67 31.18,22.11 | Q1.1 17.4,20.12 17.4,20.11
  Bottom 1.016: J1.1 40.87,96.34 J1.2 31.14,93.34 | 31.14,93.34 27.33,89.54 | 27.33,89.54 IC1.1 24.21,86.36 27.81,86.36 C5.- | C4.- 31.14,93.34 | C6.1 27.33,89.54
LED_434_RECEIVE
  Bottom 0.61: IC3.36 51.5,23.44 R76.1
LED_434_SEND
  Bottom 0.61: IC3.37 54.04,23.44 R75.1
LED_868_RECEIVE
  Bottom 0.61: IC3.34 46.42,23.44 R87.1
LED_868_SEND
  Bottom 0.61: IC3.35 48.96,23.44 R77.1
LED_DCF77  (1 unrouted)
  Bottom 0.61: IC3.38 56.58,23.44
MEMORY_CS
  Bottom 0.61: IC3.5 51.31,41.72 U$5.1
MISO  (via drill 0.8)  (2 unrouted)
  Top 0.61: v64.13,31.5 v64.13,35.94
  Bottom 0.61: 50.26,37.69 52.01,35.94 v64.13,35.94 66.8,35.94 68.45,37.59 68.45,51.94 67.06,53.34 U$2.1 60.45,59.05 U1.6 | 50.26,37.69 IC3.7 | U$5.2 50.04,47.37 50.29,47.12 50.29,37.72 50.26,37.69 | ICSP1.9 64.39,31.24 v64.13,31.5
MOSI  (via drill 0.8)  (2 unrouted)
  Top 0.61: v72.77,48.26 v70.1,48.26
  Bottom 0.61: 47.45,53.54 U$5.5 45.21,51.26 45.21,44.07 | U1.7 62.99,59.82 70.1,52.7 v70.1,48.26 70.1,37.08 67.31,34.29 50.67,34.29 45.21,39.75 45.21,44.07 | U$2.12 81.91,48.26 | 81.91,48.26 v72.77,48.26 | ICSP1.1 81.91,48.26 | IC3.6 48.96,42.48 47.5,43.94 45.34,43.94 45.21,44.07
N$1
  Bottom 1.016: J$2.SIG 72.14,16.89 U$1.ANT
N$2
  Bottom 0.61: X21.A1 80.02,79.5 R80.1
N$3
  Bottom 1.016: U$3.ANT J$3.SIG
N$4
  Bottom 0.61: R3.2 R1.1
N$5
  Bottom 0.61: R1.2 R63.2 80.77,60.96 U1.14
N$6
  Bottom 0.61: X21.A2 70.49,78.98 R81.1
N$7
  Bottom 0.61: LED8.A 60.95,10.29 51.44,19.8 R76.2
N$8
  Bottom 0.406: IC3.21 13.4,28.26 11.75,29.9 X1.4
N$9
  Bottom 0.61: X1.3 9.65,28.9 11.2,27.35 11.2,25.87 13.82,23.24 Q1.3
N$10
  Bottom 0.406: Q1.2 20.45,23.12 R7.1
N$11
  Bottom 0.406: X1.6 5.47,31.9 R5.1 R4.1
N$12
  Bottom 0.406: IC3.29 33.72,23.71 33.13,23.12 R7.2
N$13
  Bottom 0.61: LED11.A 72.14,11.81 61.72,11.81 54.1,19.43 R75.2
N$17
  Bottom 0.406: X1.7 16.17,32.9 21.02,28.05 IC3.24
N$18
  Bottom 0.406: X1.8 17.75,33.9 23.56,28.09 IC3.25
N$19
  Bottom 0.406: X1.9 19.35,34.9 26.1,28.15 IC3.26
N$20
  Bottom 0.61: R74.2 56.64,19.3 62.99,12.95 79.38,12.95 81.41,10.92 LED10.A
N$23
  Bottom 0.406: X1.10 20.84,35.9 28.64,28.1 | IC3.27 28.64,28.1 | 28.64,28.1
N$24
  Bottom 0.406: X1.11 22.43,36.9 31.18,28.15 IC3.28
N$28
  Bottom 0.61: 50.43,10.3 LED6.A 46.35,14.35 R87.2
N$29
  Bottom 0.61: R77.2 48.9,19.56 LED12.A
N$30
  Bottom 0.61: C8.1 30.03,50.53 Q2.2 31.18,46.55 IC3.13
N$33
  Bottom 0.61: X21.2 L2.1
N$34
  Bottom 0.61: R61.2 85.09,90.04 | 85.09,90.04 R64.1 | C34.2 85.09,90.04
N$35
  Bottom 0.61: X21.1 65.02,84.33 R57.2 | X21.1 68.58,84.33 | X21.1 68.96,83.31 75.69,76.58 U1.17
N$37
  Bottom 0.61: U1.16 78.1,71.5 78.1,75.82 71.5,82.42 X21.3 70.23,85.6 63.5,85.6 R58.1
N$39
  Bottom 0.406: X1.14 11.77,39.9 IC3.20
N$40
  Bottom 0.406: X1.13 13.31,38.9 IC3.19
N$41
  Bottom 0.406: X1.12 14.85,37.9 IC3.18
N$43
  Bottom 0.61: C9.1 Q2.1 33.72,46.29 IC3.12
N$49
  Bottom 0.61: FTDI1.6 15.75,45.08 14.61,46.23 C15.2
N$67  (1 unrouted)
N$94
  Bottom 0.61: X21.4 74.29,88.39 75.69,88.39 76.58,87.5 76.58,86.23 77.98,84.84 84.07,84.84 R64.2 86.49,69.22 83.19,65.91 80.01,65.91 78.23,64.14 U1.13
N$95
  Bottom 0.61: X21.6 75.31,83.44 76.33,82.42 R61.1 83.69,68.33 82.3,66.93 78.87,66.93 U1.12
N$96
  Bottom 0.61: U1.24 57.91,74.3 Q10.1 C37.2
N$97
  Bottom 0.61: U1.23 60.45,74.8 Q10.2 C38.2
N$98
  Bottom 0.813: U1.1 47.75,60.71 C40.+
N$100
  Bottom 0.61: U1.10 70.61,60.71 R65.1
N$101
  Bottom 0.61: R58.2 61.72,90.04 | 61.72,90.04 R57.1 | C32.2 61.72,90.04
N$141
  Bottom 0.61: U1.27 50.29,69.47 51.69,68.07 80.39,68.07 82.3,69.98 R80.2
N$142
  Bottom 0.61: U1.26 52.83,78.74 53.85,79.76 64.5,79.76 66.92,77.34 R81.2
N$145
  Bottom 1.016: 89.03,31.62 J$1.SIG U$2.8
RF433_RECEIVER  (via drill 0.8)  (2 unrouted)
  Top 0.61: v32.51,20.7 v32.51,24.38
  Bottom 0.61: v32.51,24.38 32.51,30.35 23.5,39.37 23.5,41.47 IC3.16 | v32.51,20.7 34.02,20.7 35.05,19.67 U$1.DATA@1
RF433_SEND
  Bottom 0.61: IC3.33 43.88,17.46 36.45,10.03 U$3.DATA
RFM12B_CS
  Bottom 0.61: U$2.14 92.58,53.34 97.03,48.89 97.03,28.96 90.68,22.61 65.34,22.61 IC3.40
RFM12B_FSK
  Bottom 0.61: IC3.1 61.66,45.53 64.39,48.26 U$2.3
RFM12B_IRQ  (1 unrouted)
  Bottom 0.61: U$2.2 64.64,50.8 60.45,46.61 60.45,39.88 58.93,38.35 55.63,38.35 54.1,39.88 54.1,41.47
RST  (via drill 0.8)
  Top 0.61: v40.13,54.74 v33.66,54.74
  Bottom 0.61: ICSP1.5 76.71,31.24 75.44,29.97 48.13,29.97 41.27,36.83 41.27,41.47 IC3.9 41.25,41.62 41.25,45.72 | RESET1.4 RESET1.3 41.25,54.74 | 41.25,54.74 41.25,45.72 | R2.1 40.91,46.06 41.25,45.72 | v40.13,54.74 41.25,54.74 | v33.66,54.74 27.3,54.74 24,51.43 16,51.43 14.61,50.04 | JP3.8 9.65,45.08 14.61,50.04 | C15.1 14.61,50.04
RXD0
  Bottom 0.61: FTDI1.4 24.77,50.16 28.07,53.47 28.58,53.47 | JP3.2 6.6,60.32 5.46,59.18 5.46,57.66 6.6,56.51 34.29,56.51 35.18,55.63 35.18,54.23 34.42,53.47 28.58,53.47 | IC3.14 28.64,53.4 28.58,53.47
SCK
  Bottom 0.61: 68.07,33.02 50.16,33.02 43.88,39.31 IC3.8 43.88,52.77 46.74,55.63 48.01,55.63 48.77,54.86 U$5.6 | 68.07,33.02 71.5,36.45 71.5,50.8 | U$2.13 71.5,50.8 | U1.8 65.53,59.18 71.5,53.21 71.5,50.8 | ICSP1.7 74.29,31.5 72.77,33.02 68.07,33.02
SCL
  Bottom 0.406: JP3.6 9.65,50.16 11.43,51.94 11.43,53.21 10.67,53.97 6.73,53.97 3.3,50.55 3.3,32 4.4,30.9 X1.5 13.29,30.9 15.94,28.25 IC3.22
SDA
  Bottom 0.406: JP3.5 8.25,52.7 5.33,49.78 R4.2 7.11,32.9 8.12,32.9 9.14,31.88 14.71,31.88 18.48,28.11 IC3.23
TXD0
  Bottom 0.61: IC3.15 26.1,46.29 24.77,47.62 FTDI1.5 14.1,47.62 10.03,43.56 7.37,43.56 6.22,44.7 6.22,46.1 7.75,47.62 JP3.7
(copper drawn outside any net)
  shapes: Bottom area x1